# Altium project Linefollower.PrjPcb
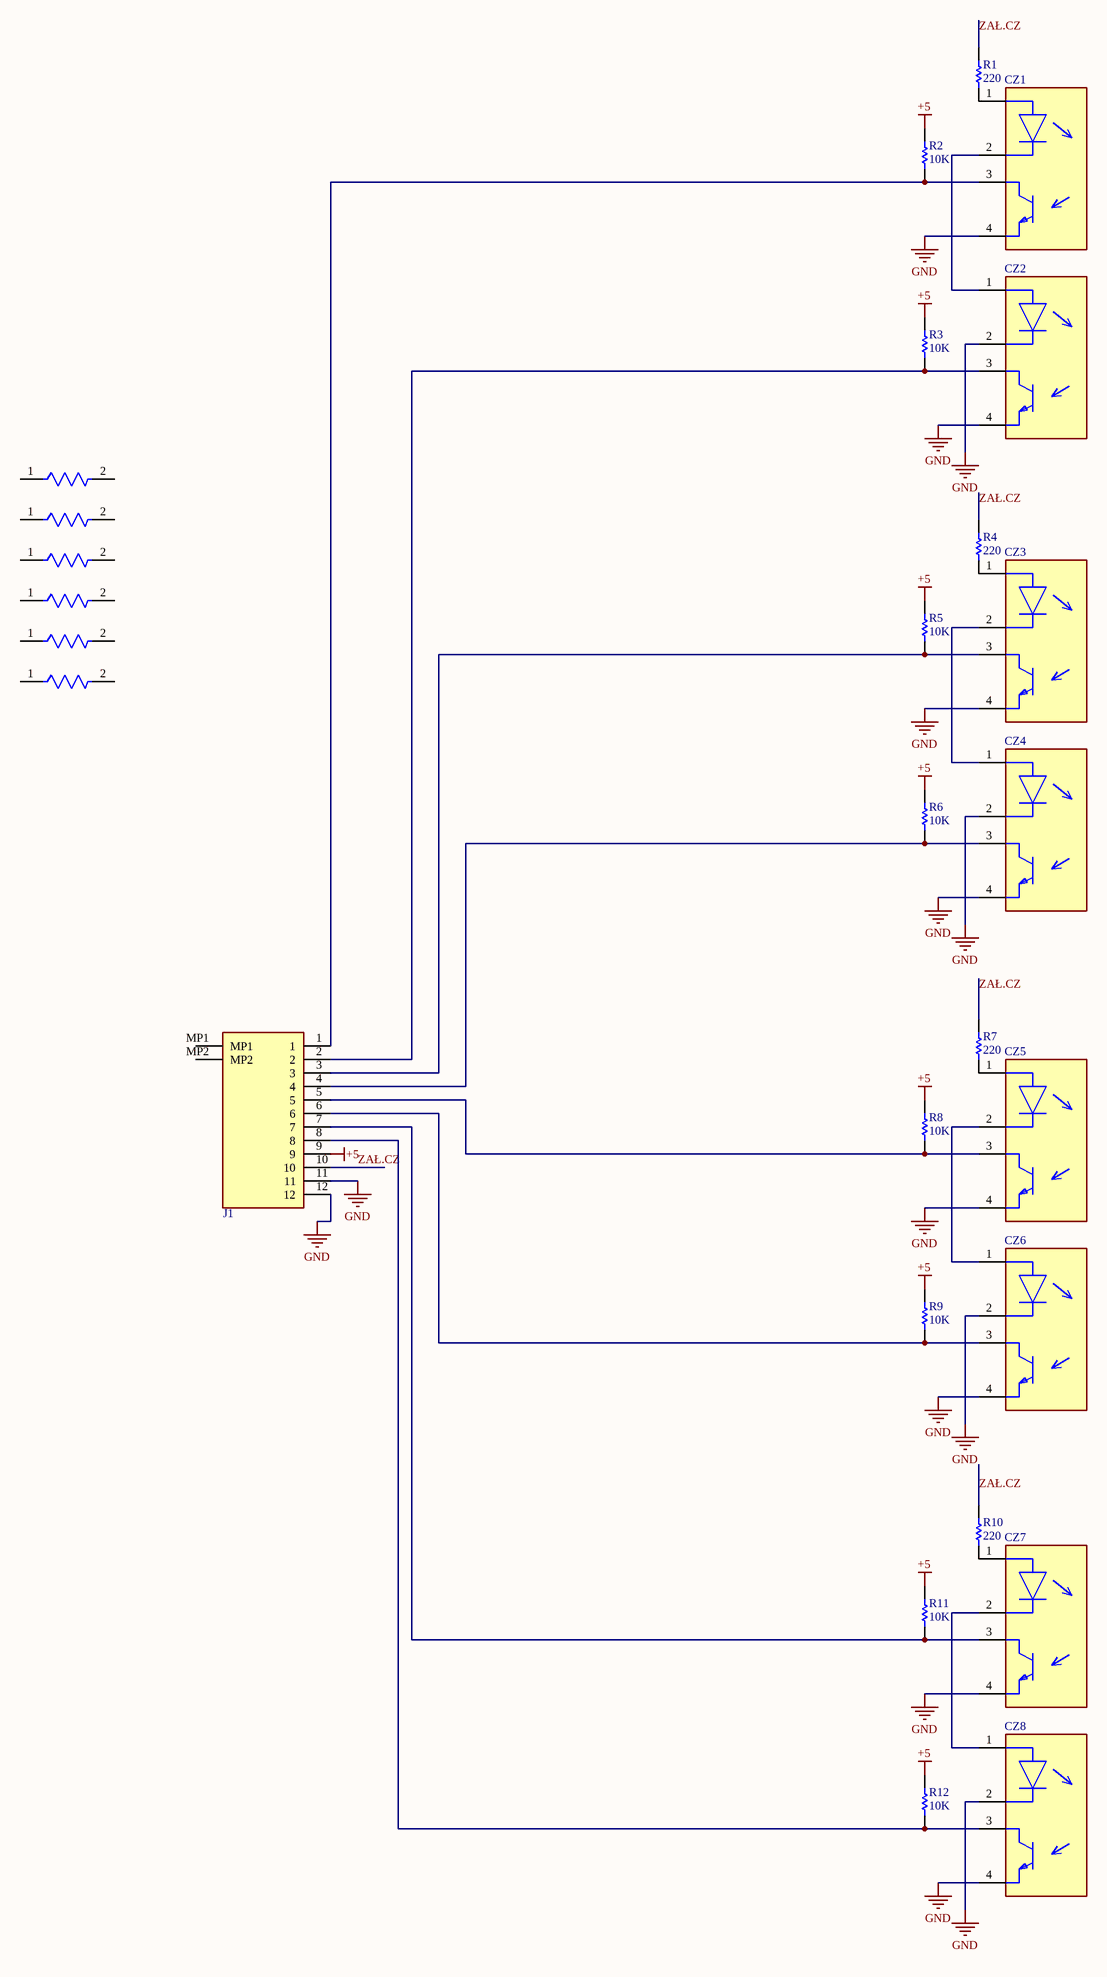
[diagram p0: czujniki.SchDoc]
7 sheets, 68 parts. Net scope: global (net labels, ports and power ports of the same name join across sheets).
Board file: PCB1.PcbDoc
Sheets:
  czujniki.SchDoc
  czujniki2.SchDoc
  sterownik silników.SchDoc
  złącze do prog.SchDoc
  zab.odw.polar..SchDoc
  stabilizator nap..SchDoc
  microcontroller.SchDoc

## Sheet czujniki.SchDoc
size A0; SheetNumber: 1; SheetTotal: 7

### Parts
(Parts that share a designator on the sheet are numbered #1, #2 ... from top to bottom, then left to right.)
CZ1  QRE1113GR  [FP-100CY-MFG]  (value not drawn)
CZ2  QRE1113GR  [FP-100CY-MFG]  (value not drawn)
CZ3  QRE1113GR  [FP-100CY-MFG]  (value not drawn)
CZ4  QRE1113GR  [FP-100CY-MFG]  (value not drawn)
CZ5  QRE1113GR  [FP-100CY-MFG]  (value not drawn)
CZ6  QRE1113GR  [FP-100CY-MFG]  (value not drawn)
CZ7  QRE1113GR  [FP-100CY-MFG]  (value not drawn)
CZ8  QRE1113GR  [FP-100CY-MFG]  (value not drawn)
J1  AFA07-S12FCA-00  [AFA07S12FCA00]  (value not drawn)
R1  220  [RESC2013X70X40NL20T20]
R2  10K  [RESC2013X60X35NL10T20]
R3  10K  [RESC2013X60X35NL10T20]
R4  220  [RESC2013X70X40NL20T20]
R5  10K  [RESC2013X60X35NL10T20]
R6  10K  [RESC2013X60X35NL10T20]
R7  220  [RESC2013X70X40NL20T20]
R8  10K  [RESC2013X60X35NL10T20]
R9  10K  [RESC2013X60X35NL10T20]
R10  220  [RESC2013X70X40NL20T20]
R11  10K  [RESC2013X60X35NL10T20]
R12  10K  [RESC2013X60X35NL10T20]
R?#1  MRS25000C1002FCT00  [FP-MRS25-MFG]  (value not drawn)
R?#2  MRS25000C1002FCT00  [FP-MRS25-MFG]  (value not drawn)
R?#3  MRS25000C1002FCT00  [FP-MRS25-MFG]  (value not drawn)
R?#4  MRS25000C1002FCT00  [FP-MRS25-MFG]  (value not drawn)
R?#5  MRS25000C1002FCT00  [FP-MRS25-MFG]  (value not drawn)
R?#6  MRS25000C1002FCT00  [FP-MRS25-MFG]  (value not drawn)

### Nets
+5: J1.9 R2.2 R3.2 R5.2 R6.2 R8.2 R9.2 R11.2 R12.2
GND: CZ1.4(E) CZ2.2(C) CZ2.4(E) CZ3.4(E) CZ4.2(C) CZ4.4(E) CZ5.4(E) CZ6.2(C) CZ6.4(E) CZ7.4(E) CZ8.2(C) CZ8.4(E) J1.11 J1.12
ZAŁ.CZ: J1.10 R1.2 R4.2 R7.2 R10.2
NetCZ1_1: CZ1.1(A) R1.1
NetCZ1_2: CZ1.2(C) CZ2.1(A)
NetCZ1_3: CZ1.3(C) J1.1 R2.1
NetCZ2_3: CZ2.3(C) J1.2 R3.1
NetCZ3_1: CZ3.1(A) R4.1
NetCZ3_2: CZ3.2(C) CZ4.1(A)
NetCZ3_3: CZ3.3(C) J1.3 R5.1
NetCZ4_3: CZ4.3(C) J1.4 R6.1
NetCZ5_1: CZ5.1(A) R7.1
NetCZ5_2: CZ5.2(C) CZ6.1(A)
NetCZ5_3: CZ5.3(C) J1.5 R8.1
NetCZ6_3: CZ6.3(C) J1.6 R9.1
NetCZ7_1: CZ7.1(A) R10.1
NetCZ7_2: CZ7.2(C) CZ8.1(A)
NetCZ7_3: CZ7.3(C) J1.7 R11.1
NetCZ8_3: CZ8.3(C) J1.8 R12.1

Not connected (* = marked no-connect by the designer): J1 MP1 MP2; R?#1 1 2; R?#2 1 2; R?#3 1 2; R?#4 1 2; R?#5 1 2; R?#6 1 2

### Library data of the parts
CZ1-CZ8 = CMP-2000-06919-2: SENSOR OPTO TRANS REFL SMD PHOTO; Wavelength: 940nm; Fall Time: 20us; Forward Current: 50mA; Max Power Dissipation: 75mW; Operating Supply Voltage: 1.7V; Reverse Voltage (DC): 5V; Max Breakdown Voltage: 30V; Forward Voltage: 1.2V; Output Type: Phototransistor; Number of Elements: 1; Sensing Distance: 0.197inch; Max Collector Current: 20mA; Contact Plating: Tin; Packaging: Tape and Reel; Rise Time: 20us; Response Time: 20us; Case/Package: SMD/SMT; REACH SVHC: No SVHC; Lead Free: Lead Free; Width: 2.9mm; Package Quantity: 1000; Mount: Surface Mount; Input Current: 50mA; Max Operating Temperature: 85°C; Weight: 0.078g; Power Dissipation: 75mW; Reverse Breakdown Voltage: 5V; Collector Emitter Voltage (VCEO): 30V; Collector Emitter Breakdown Voltage: 30V; Number of Pins: 4; Min Operating Temperature: -40°C; Radiation Hardening: No; Height: 1.7mm; Number of Channels: 1; Length: 3.6mm
J1 = AFA07-S12FCA-00: FFC, FPC Connectors P=1mm RoHS; Manufacturer_Name: JUSHUO; Geometry.Height: 2.6mm; Manufacturer_Part_Number: AFA07-S12FCA-00; Mouser Part Number: *; Mouser Price/Stock: *; Arrow Part Number: *; Arrow Price/Stock: *; Datasheet Link: https://datasheet.lcsc.com/szlcsc/JUSHUO-AFA07-S12FCA-00_C262718.pdf
R1 R4 R7 R10 = CMP-2001-00044-1: Part Number: ERJ6ENF2200V; Manufacturer: Panasonic
R2 R3 R5 R6 R8 R9 R11 R12 = CMP-1659-00013-4: Chip Resistor, 10 KOhm, +/- 1%, 0.125 W, -55 to 155 degC, 0805 (2012 Metric), RoHS, Tape and Reel; Manufacturer: Yageo; Voltage Rating: 150 V; Mount: Surface Mount; ComponentLink1Description: Manufacturer URL; ComponentLink2URL: http://www.yageo.com/documents/recent/PYu-RC_Group_51_RoHS_L_04.pdf; Pins: 2; Length: 2 mm; Min Operating Temperature: -55 degC; Height: 0.5 mm; Mounting Technology: Surface Mount; RoHSCompliant: true; REACH SVHC: No SVHC; ComponentLink1URL: http://www.yageo.com/; Max Operating Temperature: 155 degC; PackageReference: 0805; DatasheetVersion: Rev. 4, 02/2016; Package Quantity: 5000; Packaging: Tape and Reel; ComponentLink2Description: Datasheet; PackageDescription: 2-Pin Surface Mounted Device, Body 2 x 1.25 mm
R?#1-R?#6 = CMP-00030-42632392-1: MRS25000C1002FCT00 Resistor, 10 kOhm, ± 1%, 600 mW, Axial Leaded, Metal Film (Thin Film), Professional; Power Rating: 600mW; Voltage Rating (DC): 350V; Lead Length: 26mm; Resistance: 10kΩ; Temperature Coefficient: 50ppm/°C; Termination: Axial; Number of Terminations: 2; Diameter: 2.5mm; Composition: Metal Film, Thin Film; Number of Pins: 2; Length: 6.5mm; Military Standard: Not; RoHS: Compliant; NexarPartId: 42632392; Width: 2.5mm; Radiation Hardening: No; Voltage Rating: 350V; Max Power Dissipation: 600mW; Min Operating Temperature: -55°C; Lead Free: Lead Free; Max Operating Temperature: 155°C; Tolerance: 1%; Schedule B: 8533210090, 8533210090; Contact Plating: Tin; Mount: Through Hole; REACH SVHC: Unknown; Case/Package: Conformal

## Sheet czujniki2.SchDoc
size A4; SheetNumber: 2; SheetTotal: 7
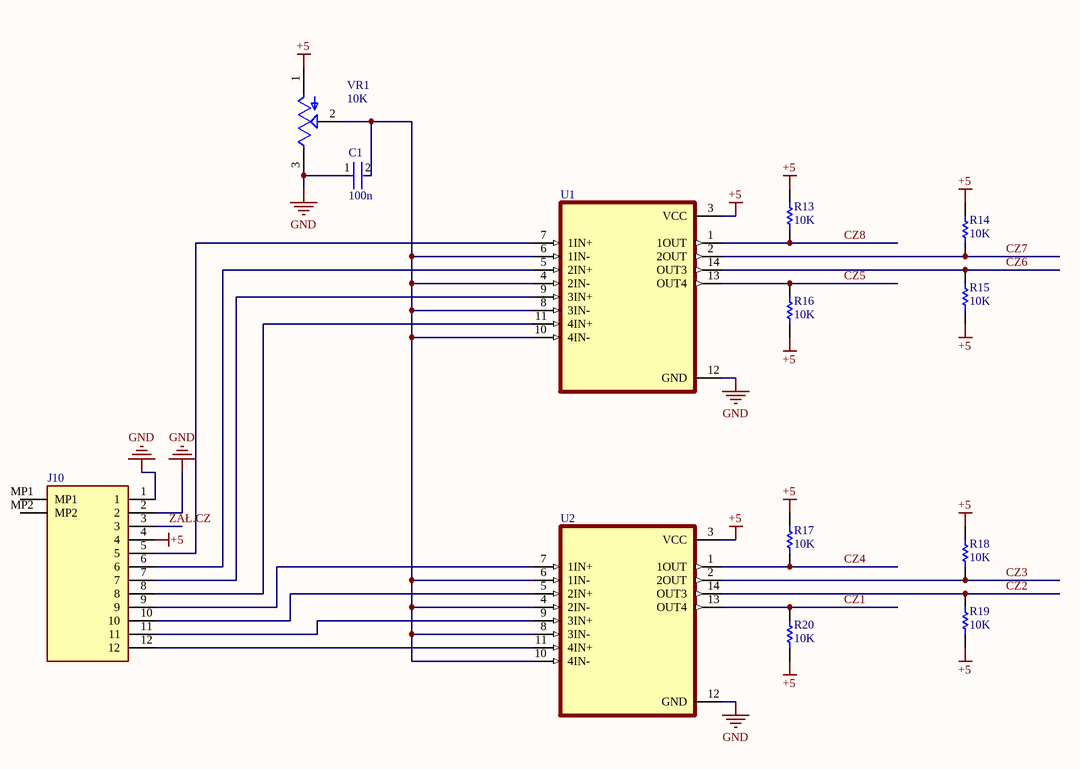
[diagram p1: czujniki2.SchDoc]

### Parts
C1  100n  [FP-0805-L_2_01_0_2-W_1_25-IPC_B]
J10  AFA07-S12FCA-00  [AFA07S12FCA00]  (value not drawn)
R13  10K  [RESC2013X60X35NL10T20]
R14  10K  [RESC2013X60X35NL10T20]
R15  10K  [RESC2013X60X35NL10T20]
R16  10K  [RESC2013X60X35NL10T20]
R17  10K  [RESC2013X60X35NL10T20]
R18  10K  [RESC2013X60X35NL10T20]
R19  10K  [RESC2013X60X35NL10T20]
R20  10K  [RESC2013X60X35NL10T20]
U1  LM339D  [SOIC127P600X175-14N]  (value not drawn)
U2  LM339D  [SOIC127P600X175-14N]  (value not drawn)
VR1  10K  [TRIM_3362P-1-103]

### Nets
+5: J10.4 R13.2 R14.2 R15.1 R16.1 R17.2 R18.2 R19.1 R20.1 U1.3(VCC) U2.3(VCC) VR1.1(CCW)
GND: C1.1 J10.1 J10.2 U1.12(GND) U2.12(GND) VR1.3(CW)
CZ1: R20.2 U2.13(OUT4)
CZ2: R19.2 U2.14(OUT3)
CZ3: R18.1 U2.2(2OUT)
CZ4: R17.1 U2.1(1OUT)
CZ5: R16.2 U1.13(OUT4)
CZ6: R15.2 U1.14(OUT3)
CZ7: R14.1 U1.2(2OUT)
CZ8: R13.1 U1.1(1OUT)
ZAŁ.CZ: J10.3
NetC1_2: C1.2 U1.4(2IN-) U1.6(1IN-) U1.8(3IN-) U1.10(4IN-) U2.4(2IN-) U2.6(1IN-) U2.8(3IN-) U2.10(4IN-) VR1.2(WIPER)
NetJ10_5: J10.5 U1.7(1IN+)
NetJ10_6: J10.6 U1.5(2IN+)
NetJ10_7: J10.7 U1.9(3IN+)
NetJ10_8: J10.8 U1.11(4IN+)
NetJ10_9: J10.9 U2.7(1IN+)
NetJ10_10: J10.10 U2.5(2IN+)
NetJ10_11: J10.11 U2.9(3IN+)
NetJ10_12: J10.12 U2.11(4IN+)

Not connected (* = marked no-connect by the designer): J10 MP1 MP2

### Library data of the parts
C1 = CMP-2007-04174-2: General Purpose Ceramic Capacitor, 0805, 100nF, 10%, X7R, 15%, 100V; Packaging: Tape and Reel; Min Operating Temperature: -55°C; Dielectric Material: Ceramic; Height: 1.4mm; Voltage Rating: 100V; Termination: SMD/SMT; Case Code (Imperial): 0805; Case Code (Metric): 2012; Case/Package: 0805; Construction: Flat; Radiation Hardening: No; Series: -; Dielectric: X7R; Package Quantity: 2000; Mount: Surface Mount; Capacitance: 100nF; Contact Plating: Tin; Voltage: 100V; Lead Free: Lead Free; Depth: 1.25mm; RoHS Compliant: Yes; Number of Pins: 2; Max Operating Temperature: 125°C; Length: 2.01mm; Voltage Rating (DC): 100V; Thickness: 0.055inch; REACH SVHC: No SVHC; Width: 0.049inch; Tolerance: 10%
J10 = AFA07-S12FCA-00: as J1 on sheet czujniki; Manufacturer_Part_Number: AFA07-S12FCA-00; Mouser Part Number: *; Mouser Price/Stock: *; Arrow Part Number: *; Arrow Price/Stock: *; Datasheet Link: https://datasheet.lcsc.com/szlcsc/JUSHUO-AFA07-S12FCA-00_C262718.pdf
R13-R20 = CMP-1659-00013-4: as R2 on sheet czujniki; Mount: Surface Mount; ComponentLink1Description: Manufacturer URL; ComponentLink2URL: http://www.yageo.com/documents/recent/PYu-RC_Group_51_RoHS_L_04.pdf; Pins: 2; Length: 2 mm; Min Operating Temperature: -55 degC; Height: 0.5 mm; Mounting Technology: Surface Mount; RoHSCompliant: true; REACH SVHC: No SVHC; ComponentLink1URL: http://www.yageo.com/; Max Operating Temperature: 155 degC; PackageReference: 0805; DatasheetVersion: Rev. 4, 02/2016; Package Quantity: 5000; Packaging: Tape and Reel; ComponentLink2Description: Datasheet; PackageDescription: 2-Pin Surface Mounted Device, Body 2 x 1.25 mm
VR1 = 3362P-1-103: 10 kOhms 0.5W, 1/2W PC Pins Through Hole Trimmer Potentiometer Cermet 1 Turn Top Adjustment; MF: Bourns; Availability: Unavailable; Check_prices: https://www.snapeda.com/parts/3362P-1-103/Bourns/view-part/1483042/?ref=eda; Package: 3116 Bourns; Price: None; SnapEDA_Link: https://www.snapeda.com/parts/3362P-1-103/Bourns/view-part/1483042/?ref=snap; Value: *; MP: 3362P-1-103
U1 U2 = LM339D: Price: None; Value: *; Package: None; Availability: Unavailable; MP: LM339D

## Sheet sterownik silników.SchDoc
size A4; SheetNumber: 3; SheetTotal: 7
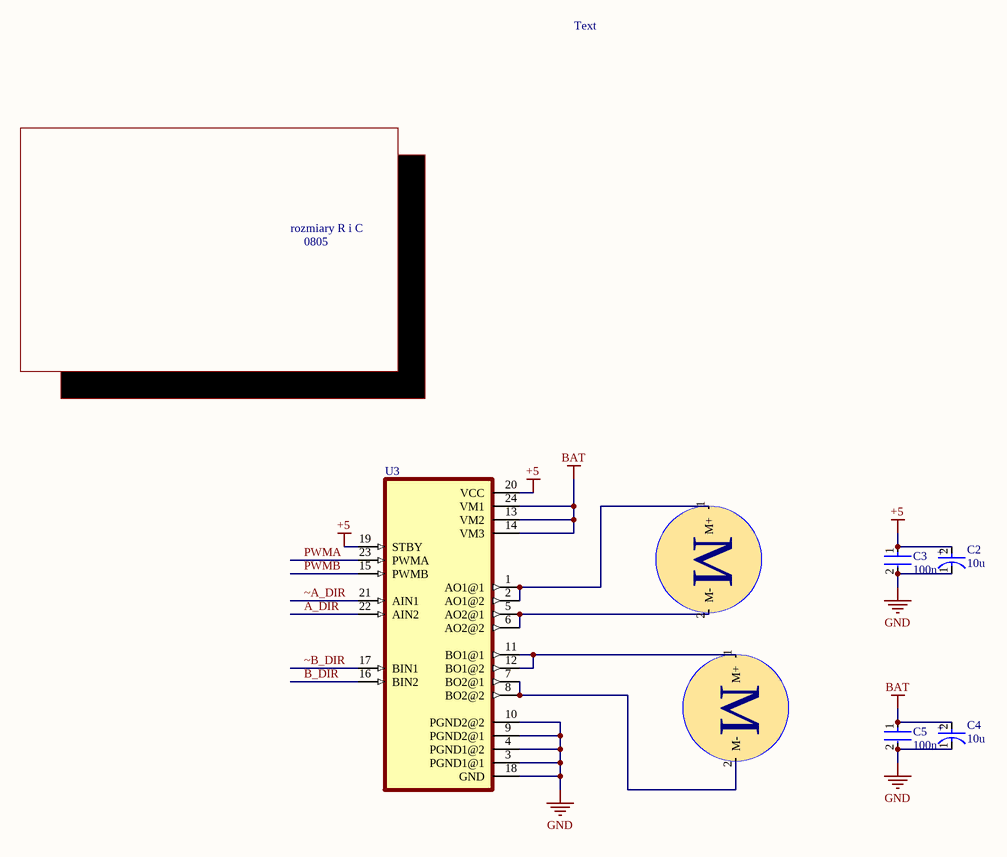
[diagram p2: sterownik silników.SchDoc]

### Parts
(Parts that share a designator on the sheet are numbered #1, #2 ... from top to bottom, then left to right.)
#1  Component_1  [PCBComponent_1]  (value not drawn)
#2  Component_1  [PCBComponent_1]  (value not drawn)
C2  10u  [FP-TAJP-MFG]
C3  100n  [FP-0805-L_2_01_0_2-W_1_25-IPC_B]
C4  10u  [FP-TAJP-MFG]
C5  100n  [FP-0805-L_2_01_0_2-W_1_25-IPC_B]
U3  TB6612FNG(O,C,8,EL  [SOP65P760X160-24N]  (value not drawn)

### Nets
+5: C2.2(A) C3.1 U3.19(STBY) U3.20(VCC)
BAT: C4.2(A) C5.1 U3.13(VM2) U3.14(VM3) U3.24(VM1)
GND: C2.1(C) C3.2 C4.1(C) C5.2 U3.3(PGND1@1) U3.4(PGND1@2) U3.9(PGND2@1) U3.10(PGND2@2) U3.18(GND)
A_DIR: U3.22(AIN2)
B_DIR: U3.16(BIN2)
PWMA: U3.23(PWMA)
PWMB: U3.15(PWMB)
~A_DIR: U3.21(AIN1)
~B_DIR: U3.17(BIN1)
Net#1_1: #1.1(M+) U3.1(AO1@1) U3.2(AO1@2)
Net#1_2: #1.2(M-) U3.5(AO2@1) U3.6(AO2@2)
Net#2_1: #2.1(M+) U3.11(BO1@1) U3.12(BO1@2)
Net#2_2: #2.2(M-) U3.7(BO2@1) U3.8(BO2@2)

### Notes on the sheet
- Text
- rozmiary R i C
- 0805
- (in symbol CMP-2007-04028-2) +
- (in symbol Component_1) M

### Library data of the parts
C2 C4 = CMP-2007-04028-2: 10uF 10V  ±20% 6Ω 0805  SMD Tantalum Capacitor; Dissipation Factor: 8%; ESR (Equivalent Series Resistance): 6R; Polarity: Polar; Leakage Current: 1uA; Height: 1.5mm; Packaging: Tape and Reel; Max Operating Temperature: 125°C; Lead Free: Lead Free; Length: 2.05mm; RoHS Compliant: Yes; Number of Pins: 2; Case Code (Metric): 2012; Series: TAJ; Height - Seated (Max): 0.059inch; Mount: Surface Mount; REACH SVHC: No SVHC; Depth: 1.35mm; Tolerance: 20%; Case Code (Imperial): 0805; Dielectric Material: Tantalum; Features: General Purpose; Voltage: 10V; Capacitance: 10uF; Package Quantity: 1; Case/Package: 0805; Voltage Rating (DC): 10V; Termination: SMD/SMT; Width: 0.053inch; Min Operating Temperature: -55°C; Voltage Rating: 10V
C3 C5 = CMP-2007-04174-2: as C1 on sheet czujniki2; Packaging: Tape and Reel; Min Operating Temperature: -55°C; Dielectric Material: Ceramic; Height: 1.4mm; Voltage Rating: 100V; Termination: SMD/SMT; Case Code (Imperial): 0805; Case Code (Metric): 2012; Case/Package: 0805; Construction: Flat; Radiation Hardening: No; Series: -; Dielectric: X7R; Package Quantity: 2000; Mount: Surface Mount; Capacitance: 100nF; Contact Plating: Tin; Voltage: 100V; Lead Free: Lead Free; Depth: 1.25mm; RoHS Compliant: Yes; Number of Pins: 2; Max Operating Temperature: 125°C; Length: 2.01mm; Voltage Rating (DC): 100V; Thickness: 0.055inch; REACH SVHC: No SVHC; Width: 0.049inch; Tolerance: 10%
U3 = TB6612FNG(O,C,8,EL: DC Motor Driver 3V 24-Pin SSOP T/R; MF: Toshiba; Check_prices: https://www.snapeda.com/parts/TB6612FNG(O,C,8,EL/Toshiba/view-part/?ref=eda; Package: SSOP-24 Toshiba; Availability: Not in stock; Value: *; MP: TB6612FNG(O,C,8,EL; SnapEDA_Link: https://www.snapeda.com/parts/TB6612FNG(O,C,8,EL/Toshiba/view-part/?ref=snap; Price: None

## Sheet złącze do prog.SchDoc
size A4; SheetNumber: 4; SheetTotal: 7
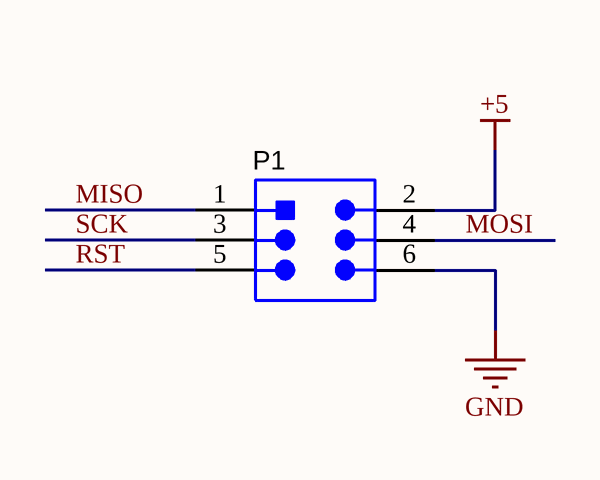
[diagram p3: złącze do prog.SchDoc]

### Parts
P1  TSW-103-07-G-D  [SMTC-TSW-103-07-G-D_V]  (value not drawn)

### Nets
+5: P1.2
GND: P1.6
MISO: P1.1
MOSI: P1.4
RST: P1.5
SCK: P1.3

### Library data of the parts
P1 = CMP-2000-07329-1: Through Hole Header, Pitch 2.54 mm, 2 x 3 Position, Height 8.58 mm, Tail Length 2.54 mm, -55 to 125 degC, RoHS, Bulk; Manufacturer: Samtec-Inc.; Number of Positions Loaded: All; Number of Positions: 6; Row Spacing: 0.100"(2.54mm); Connector Type: Header,Unshrouded; Package Reference: TSW-103-07-G-D; Termination: Solder; Manufacturer URL: http://www.samtec.com/; Contact Finish: Gold; Contact Mating Length: 0.230"(5.84mm); Package Description: Through Hole Header, Pitch 2.54 mm, 2 x 3 Position, Height 8.58 mm, Tail Length 2.54 mm; Datasheet Version: 12/2015; Number of Rows: 2; Features: -; Family: RectangularConnectors-Headers,MalePins; Fastening Type: -; Datasheet URL: http://suddendocs.samtec.com/catalog_english/tsw_th.pdf; Category: Connectors,Interconnects; Package URL: http://suddendocs.samtec.com/prints/tsw-xxx-xx-xxx-x-xx-xxx-mkt.pdf; Mounting Type: ThroughHole; Contact Finish Thickness: 10µin(0.25µm); Packaging: Bulk; Color: Black; Pitch: 0.100"(2.54mm); Series: TSW; Contact Type: MalePin; Mounting Technology: ThroughHole

## Sheet zab.odw.polar..SchDoc
size A4; SheetNumber: 5; SheetTotal: 7
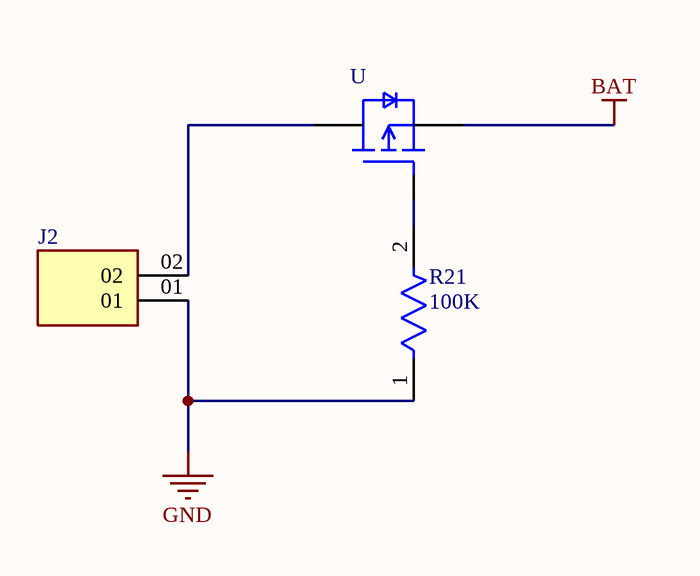
[diagram p4: zab.odw.polar..SchDoc]

### Parts
(Parts that share a designator on the sheet are numbered #1, #2 ... from top to bottom, then left to right.)
J2  HTSW-102-08-L-S  [SAMTEC_HTSW-102-08-L-S]  (value not drawn)
R21  100K  [FP-RC0805-0_6-IPC_C]
U#1  (no value)  [SOT23-3]

### Nets
BAT: U#1.2(S)
GND: J2.01 R21.1
NetJ2_02: J2.02 U#1.3(D)
NetR21_2: R21.2 U#1.1(G)

### Library data of the parts
J2 = HTSW-102-08-L-S: Conn Unshrouded Header HDR 2 POS 2.54mm Solder ST Top Entry Thru-Hole Bag; MF: Samtec Inc.; SnapEDA_Link: https://www.snapeda.com/parts/HTSW-102-08-L-S/Samtec/view-part/?ref=snap; Package: None; MP: HTSW-102-08-L-S; Check_prices: https://www.snapeda.com/parts/HTSW-102-08-L-S/Samtec/view-part/?ref=eda; Purchase-URL: https://pricing.snapeda.com/search/part/HTSW-102-08-L-S/?ref=eda; Price: None; Value: *; Availability: In Stock
R21 = CMP-2100-03668-5: RES 100K OHM 1% 1/8W 0805; Power Rating: 125mW; Temperature Coefficient: 100ppm/°C; Voltage Rating (DC): 150V; Resistance: 100kR; Package Quantity: 1; Case/Package: 0805; Lead Pitch: 0.4mm; Case Code (Imperial): 0805; Construction: Rectangular; Number of Terminations: 2; RoHS Compliant: Yes; Max Power Dissipation: 125mW; Tolerance: 1%; Max Operating Temperature: 155°C; Resistance Tolerance: 1%; Lead Free: Lead Free; Packaging: Tape and Reel; Resistor Type: Thick Film; Min Operating Temperature: -55°C; Case Code (Metric): 2012; Series: RC; Technology: THICK FILM; Voltage Rating: 150V; Termination: SMD/SMT; Width: 0.049inch; Number of Pins: 2; Features: Moisture Resistant; Military Standard: Not; Length: 0.079inch; Depth: 1.25mm; Size Code: 0805; Height: 0.024inch
U#1 = AO3401: P-Channel 30V 4A (Ta) 1.4W (Ta) Surface Mount SOT-23-3L; MF: Alpha & Omega Semiconductor; Price: None; SnapEDA_Link: https://www.snapeda.com/parts/AO3401/Alpha%20&%20Omega%20Semiconductor/view-part/4795619/?ref=snap; Arrow_Electronics-Purchase-URL: https://snapeda.com/shop?store=Arrow+Electronics&id=4795619; Availability: Warning; MP: AO3401; Value: *; Package: SOT-23-3 Alpha &amp; Omega Semiconductor

## Sheet stabilizator nap..SchDoc
size A4; SheetNumber: 6; SheetTotal: 7
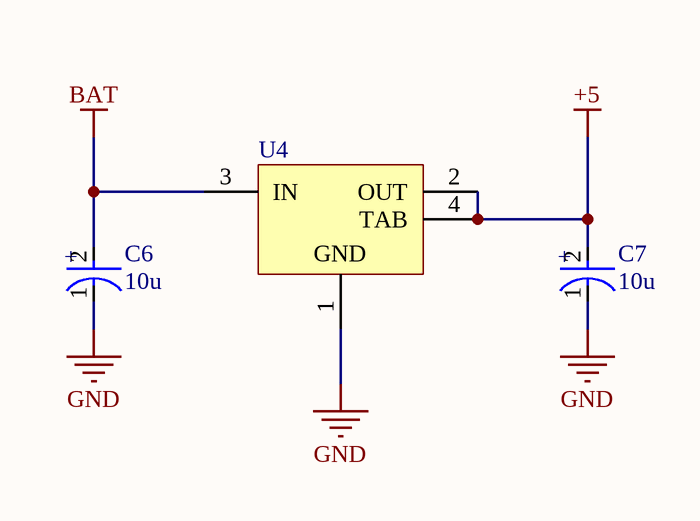
[diagram p5: stabilizator nap..SchDoc]

### Parts
C6  10u  [FP-TAJP-MFG]
C7  10u  [FP-TAJP-MFG]
U4  LM1117MPX-5.0/NOPB  [DCY0004A_L]  (value not drawn)

### Nets
+5: C7.2(A) U4.2(OUT) U4.4(TAB)
BAT: C6.2(A) U4.3(IN)
GND: C6.1(C) C7.1(C) U4.1(GND)

### Notes on the sheet
- (in symbol CMP-2007-04028-2) +

### Library data of the parts
C6 C7 = CMP-2007-04028-2: as C2 on sheet sterownik silników; Height: 1.5mm; Packaging: Tape and Reel; Max Operating Temperature: 125°C; Lead Free: Lead Free; Length: 2.05mm; RoHS Compliant: Yes; Number of Pins: 2; Case Code (Metric): 2012; Series: TAJ; Height - Seated (Max): 0.059inch; Mount: Surface Mount; REACH SVHC: No SVHC; Depth: 1.35mm; Tolerance: 20%; Case Code (Imperial): 0805; Dielectric Material: Tantalum; Features: General Purpose; Voltage: 10V; Capacitance: 10uF; Package Quantity: 1; Case/Package: 0805; Voltage Rating (DC): 10V; Termination: SMD/SMT; Width: 0.053inch; Min Operating Temperature: -55°C; Voltage Rating: 10V
U4 = CMP-0062-01635-4: 800mA Low-Dropout Linear Regulator, 4-pin SOT-223, Pb-Free; Manufacturer: Texas Instruments; PowerWise: N; High-Reliability: Y; PackageTopMarking: XYTT*N06A; CompType: LDO IC; PartNumber: LM1117MPX-5.0/NOPB; Code_JEDEC: TO-261-AA; Code_IPC: SOT223-4; ComponentLink1URL: http://www.ti.com/general/docs/lit/getliterature.tsp?genericPartNumber=LM1117-N&fileType=pdf; PinCount: 4; PackageReference: DCY0004A; ComponentLink1Description: Datasheet URL; PackageDescription: Molded SOT-223, 6.50 x 3.56 x 1.6mm Body, 4 Lead, 2.3mm Pitch; RoHS: Y

## Sheet microcontroller.SchDoc
size A4; SheetNumber: 7; SheetTotal: 7
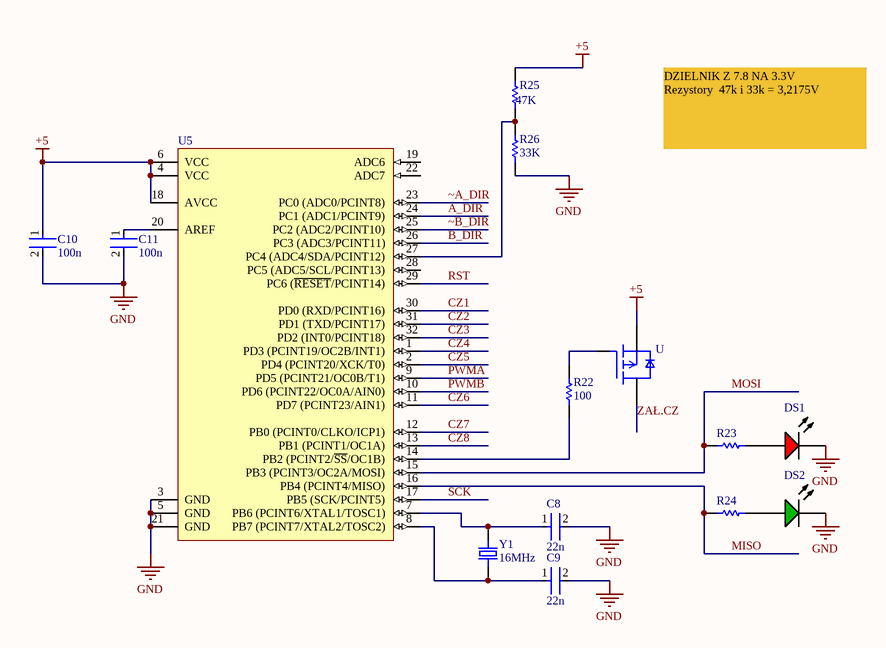
[diagram p6: microcontroller.SchDoc]

### Parts
(Parts that share a designator on the sheet are numbered #1, #2 ... from top to bottom, then left to right.)
C8  22n  [FP-C0805C-DN-MFG]
C9  22n  [FP-C0805C-DN-MFG]
C10  100n  [FP-0805-L_2_01_0_2-W_1_25-IPC_B]
C11  100n  [FP-0805-L_2_01_0_2-W_1_25-IPC_B]
DS1  HSMS-C190  [AVAG-HSMX-C190_V]  (value not drawn)
DS2  HSMG-C190  [AVAG-HSMX-C190_V]  (value not drawn)
R22  100  [RESC2013X50X30LL20T20]
R23  (no value)  [RESC2013X50X30LL20T20]
R24  (no value)  [RESC2013X50X30LL20T20]
R25  47K  [RESC2013X70X40ML20T20]
R26  33K  [RESC2013X60X40NL20T25]
U5  ATmega328P-AU  [32A_M]  (value not drawn)
U#2  (no value)  [SOT23-3]
Y1  16MHz  [XTAL_ECS-160-20-4X]

### Nets
+5: C10.1 R25.2 U5.4(VCC) U5.6(VCC) U5.18(AVCC) U#2.2(S)
GND: C8.2 C9.2 C10.2 C11.2 DS1.2(K) DS2.2(K) R26.1 U5.3(GND) U5.5(GND) U5.21(GND)
A_DIR: U5.24(PC1_(ADC1/PCINT9))
B_DIR: U5.26(PC3_(ADC3/PCINT11))
CZ1: U5.30(PD0_(RXD/PCINT16))
CZ2: U5.31(PD1_(TXD/PCINT17))
CZ3: U5.32(PD2_(INT0/PCINT18))
CZ4: U5.1(PD3_(PCINT19/OC2B/INT1))
CZ5: U5.2(PD4_(PCINT20/XCK/T0))
CZ6: U5.11(PD7_(PCINT23/AIN1))
CZ7: U5.12(PB0_(PCINT0/CLKO/ICP1))
CZ8: U5.13(PB1_(PCINT1/OC1A))
MISO: R24.1 U5.16(PB4_(PCINT4/MISO))
MOSI: R23.1 U5.15(PB3_(PCINT3/OC2A/MOSI))
PWMA: U5.9(PD5_(PCINT21/OC0B/T1))
PWMB: U5.10(PD6_(PCINT22/OC0A/AIN0))
RST: U5.29(PC6_(~{RESET}/PCINT14))
SCK: U5.17(PB5_(SCK/PCINT5))
ZAŁ.CZ: U#2.3(D)
~A_DIR: U5.23(PC0_(ADC0/PCINT8))
~B_DIR: U5.25(PC2_(ADC2/PCINT10))
NetC8_1: C8.1 U5.7(PB6_(PCINT6/XTAL1/TOSC1)) Y1.2
NetC9_1: C9.1 U5.8(PB7_(PCINT7/XTAL2/TOSC2)) Y1.1
NetC11_1: C11.1 U5.20(AREF)
NetDS1_1: DS1.1(A) R23.2
NetDS2_1: DS2.1(A) R24.2
NetR22_1: R22.1 U5.14(PB2_(PCINT2/~{SS}/OC1B))
NetR22_2: R22.2 U#2.1(G)
NetR25_1: R25.1 R26.2 U5.27(PC4_(ADC4/SDA/PCINT12))

Not connected (* = marked no-connect by the designer): U5 19(ADC6) 22(ADC7) 28(PC5_(ADC5/SCL/PCINT13))

### Notes on the sheet
- DZIELNIK Z 7.8 NA 3.3V
  Rezystory  47k i 33k = 3,2175V

### Library data of the parts
C8 C9 = CMP-2007-00338-2: CAP CER 0.022UF 50V X7R 0805; Manufacturer: KEMET; Manufacturer Part Number: C0805C223K5RACTU; Value: 22,000 pF; Material: Ceramic; Tolerance: 0.1; Temperature Coefficient: 30ppm/°C; Description: C0805 22,000 pF X7R 30ppm/°C 10.00% 50 V; Automotive: No; Package: C0805C-DN; RoHS: TRUE; Height: 0.88mm; Lead Free: Yes; Temperature Range Low: -55°C; Digikey Description: CAP CER 0.022UF 50V X7R 0805; ComponentLink2Description: Datasheet; Capacitance: 22,000 pF; Mouser Description: Capacitor; Ceramic; Cap; .022uF; Tol 10%; SMT; Vol-Rtg 50V; X7R; Tape and Reel; Device Class L3: Ceramic Capacitors; Category: Cap; Voltage Rating: 50 V; Temperature Characteristic: X7R; Ipc Land Pattern Name: CAPC200125X78; Octopart: https://octopart.com/c0805c223k5ractu-kemet-145968; Device Class L1: Passive Components; Temperature: -55°C to +125°C; ComponentLink2URL: https://content.kemet.com/datasheets/KEM_C1003_C0G_SMD.pdf; Temperature Range High: +125°C; Device Class L2: Capacitors
C10 C11 = CMP-2007-04174-2: as C1 on sheet czujniki2; Packaging: Tape and Reel; Min Operating Temperature: -55°C; Dielectric Material: Ceramic; Height: 1.4mm; Voltage Rating: 100V; Termination: SMD/SMT; Case Code (Imperial): 0805; Case Code (Metric): 2012; Case/Package: 0805; Construction: Flat; Radiation Hardening: No; Series: -; Dielectric: X7R; Package Quantity: 2000; Mount: Surface Mount; Capacitance: 100nF; Contact Plating: Tin; Voltage: 100V; Lead Free: Lead Free; Depth: 1.25mm; RoHS Compliant: Yes; Number of Pins: 2; Max Operating Temperature: 125°C; Length: 2.01mm; Voltage Rating (DC): 100V; Thickness: 0.055inch; REACH SVHC: No SVHC; Width: 0.049inch; Tolerance: 10%
DS1 = CMP-2000-06427-1: LED Uni-Color Red, 52 mW, 20 mA, -40 to 85 degC, 2-Pin SMD, RoHS, Tape and Reel; Manufacturer: Avago; Reverse Voltage: 5V; Viewing Angle: 170deg; High Brightness: No; Lens Type: ColorlessDiffused; DELETED: Compliant; Product Height (mm): 0.8mm; Dominant Wave Length: 626nm; Number of  Elements: 1; Chip Material: GaP; Lum Intensity: 10mcd; Product Length (mm): 1.6mm; Forward Voltage: 2.6V; Power Dissipation: 52W; Shape Type: Rectangular; Forward Current: 25mA; Peak Wavelength: 630nm; Test Current (It): 20mA; Main Category: ChipLED; Lens Dimensions: 1x0.8x0.5mm; Pin Count: 2; Package Reference: HSMX-C190; Mounting Technology: SurfaceMount; Mounting: SurfaceMount; Datasheet URL: http://docs.avagotech.com/docs/AV02-0551EN; Package Type: ChipLed; Operating Temperature Classification: Industrial; Datasheet Version: 03/2012; Operating Temp Range: -40Cto85C; Emitting Color: Red; Rad Hardened: No; Manufacturer URL: http://www.avagotech.com/; Luminous Intensity: 10mcd; Package Description: 2-Pin Surface Mount Device, Body 1.6 x 0.8 mm, Height 0.9 mm; Type: Uni-Color; Packaging: TapeandReel; Product Depth (mm): 0.8mm
DS2 = CMP-1744-00002-1: Chip LED, Green, 2.2 V, -40 to 85 degC, 2-Pin SMD, RoHS, Tape and Reel; Frequency: 400 KHz; Max Supply Voltage: 5.5 V; Access Time: 3500 ns; Clock Frequency: 100 KHz; Case\Package: SOIC; Density: 32 kb; Nominal Supply Current: 2 mA; Interface: Serial; Min Supply Voltage: 1.7 V; Packaging: Tape and Reel; PackageReference: HSMX-C190; ComponentLink2URL: http://docs.avagotech.com/docs/AV02-0551EN; RoHSCompliant: true; Pins: 8; REACH SVHC: No SVHC; Max Operating Temperature: 85 degC; Width: 4 mm; Radiation Hardening: No; Package Quantity: 3000; ComponentLink3Description: Package Specification; ComponentLink1Description: Manufacturer URL; Min Operating Temperature: -40 degC; PackageDescription: 2-Pin Surface Mount Device, Body 1.6 x 0.8 mm, Height 0.9 mm; Max Clock Frequency: 100 KHz; Height: 1.5 mm; ComponentLink1URL: http://www.avagotech.com/; DatasheetVersion: Mar-12; ComponentLink2Description: Datasheet; Mount: Surface Mount; Length: 5 mm; ComponentLink3URL: http://www.fairchildsemi.com/dwg/MA/MA03D.pdf
R22 = CMP-2001-04901-1: Manufacturer: Vishay Dale; Part Number: CRCW0805100RFKEA
R23 R24 = CMP-2001-03932-1: Manufacturer: Vishay Dale; Part Number: CRCW0805470RFKEA
R25 = CMP-2001-00551-1: Manufacturer: Panasonic; Part Number: ERJ6ENF4702V
R26 = CMP-2001-00630-1: Manufacturer: Panasonic; Part Number: ERA6AEB333V
U5 = CMP-0095-00269-2: 8-bit AVR Microcontroller, 32KB Flash, 1KB EEPROM, 2KB SRAM, 32-pin TQFP, Industrial Grade (-40°C to 85°C); PackageDescription: 32-Lead, 7x7x1.0 mm Body, 0.8mm Lead Pitch, Thin Profile Plastic Quad Flat Package (TQFP); DatasheetVersion: revD, May-2011; RevisionNote: DatasheetVersion & PackageVersion updated. URLs added.; ComponentLink1URL: http://www.atmel.com/; ComponentLink2Description: ATmega48A/48PA/88A/88PA/168A/168PA/328/328P Datasheet; Code_JEDEC: MS-026-ABA; ComponentLink1Description: Manufacturer URL; PackageReference: 32A; ComponentLink3Description: ATmega48A/48PA/88A/88PA/168A/168PA/328/328P Summary; ComponentLink2URL: http://www.atmel.com/dyn/resources/prod_documents/doc8271.pdf; PackageVersion: revC, Oct-2010; ComponentLink3URL: http://www.atmel.com/dyn/resources/prod_documents/8271S.pdf
U#2 = AO3401: as U#1 on sheet zab.odw.polar.; Price: None; SnapEDA_Link: https://www.snapeda.com/parts/AO3401/Alpha%20&%20Omega%20Semiconductor/view-part/4795619/?ref=snap; Arrow_Electronics-Purchase-URL: https://snapeda.com/shop?store=Arrow+Electronics&id=4795619; Availability: Warning; MP: AO3401; Value: *; Package: SOT-23-3 Alpha &amp; Omega Semiconductor
Y1 = ECS-121-S-4X_12.096: CRYSTAL T/H; MP: ECS-121-S-4X 12.096; Package: None; Price: None; Value: *; Availability: Unavailable

## Nets that join several sheets
+5: czujniki (9 pins), czujniki2 (12 pins), sterownik silników (C2.2 C3.1 U3.19 U3.20), złącze do prog (P1.2), stabilizator nap. (C7.2 U4.2 U4.4), microcontroller (6 pins)
BAT: sterownik silników (5 pins), zab.odw.polar. (U#1.2), stabilizator nap. (C6.2 U4.3)
GND: czujniki (14 pins), czujniki2 (6 pins), sterownik silników (9 pins), złącze do prog (P1.6), zab.odw.polar. (J2.01 R21.1), stabilizator nap. (C6.1 C7.1 U4.1), microcontroller (10 pins)
A_DIR: sterownik silników (U3.22), microcontroller (U5.24)
B_DIR: sterownik silników (U3.16), microcontroller (U5.26)
CZ1: czujniki2 (R20.2 U2.13), microcontroller (U5.30)
CZ2: czujniki2 (R19.2 U2.14), microcontroller (U5.31)
CZ3: czujniki2 (R18.1 U2.2), microcontroller (U5.32)
CZ4: czujniki2 (R17.1 U2.1), microcontroller (U5.1)
CZ5: czujniki2 (R16.2 U1.13), microcontroller (U5.2)
CZ6: czujniki2 (R15.2 U1.14), microcontroller (U5.11)
CZ7: czujniki2 (R14.1 U1.2), microcontroller (U5.12)
CZ8: czujniki2 (R13.1 U1.1), microcontroller (U5.13)
MISO: złącze do prog (P1.1), microcontroller (R24.1 U5.16)
MOSI: złącze do prog (P1.4), microcontroller (R23.1 U5.15)
PWMA: sterownik silników (U3.23), microcontroller (U5.9)
PWMB: sterownik silników (U3.15), microcontroller (U5.10)
RST: złącze do prog (P1.5), microcontroller (U5.29)
SCK: złącze do prog (P1.3), microcontroller (U5.17)
ZAŁ.CZ: czujniki (5 pins), czujniki2 (J10.3), microcontroller (U#2.3)
~A_DIR: sterownik silników (U3.21), microcontroller (U5.23)
~B_DIR: sterownik silników (U3.17), microcontroller (U5.25)